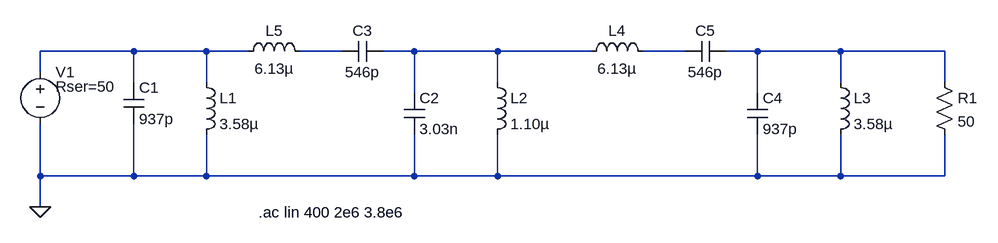
[diagram p0: schematic simple.asc]
simple.asc, the LTspice schematic file:
Version 4
SHEET 1 1604 692
WIRE 304 192 160 192
WIRE 416 192 304 192
WIRE 480 192 416 192
WIRE 624 192 560 192
WIRE 736 192 688 192
WIRE 864 192 736 192
WIRE 1008 192 864 192
WIRE 1152 192 1088 192
WIRE 1264 192 1216 192
WIRE 1392 192 1264 192
WIRE 1552 192 1392 192
WIRE 160 224 160 192
WIRE 304 240 304 192
WIRE 416 240 416 192
WIRE 864 240 864 192
WIRE 1392 240 1392 192
WIRE 1552 240 1552 192
WIRE 736 256 736 192
WIRE 1264 256 1264 192
WIRE 160 384 160 304
WIRE 304 384 304 304
WIRE 304 384 160 384
WIRE 416 384 416 320
WIRE 416 384 304 384
WIRE 736 384 736 320
WIRE 736 384 416 384
WIRE 864 384 864 320
WIRE 864 384 736 384
WIRE 1264 384 1264 320
WIRE 1264 384 864 384
WIRE 1392 384 1392 320
WIRE 1392 384 1264 384
WIRE 1552 384 1552 320
WIRE 1552 384 1392 384
WIRE 160 432 160 384
FLAG 160 432 0
SYMBOL voltage 160 208 R0
WINDOW 39 24 38 Left 2
SYMATTR SpiceLine Rser=50
SYMATTR InstName V1
SYMATTR Value ""
SYMATTR Value2 AC 1
SYMBOL cap 288 240 R0
SYMATTR InstName C1
SYMATTR Value 937p
SYMBOL cap 720 256 R0
SYMATTR InstName C2
SYMATTR Value 3.03n
SYMBOL cap 688 176 R90
WINDOW 0 0 32 VBottom 2
WINDOW 3 32 32 VTop 2
SYMATTR InstName C3
SYMATTR Value 546p
SYMBOL ind 400 224 R0
SYMATTR InstName L1
SYMATTR Value 3.58µ
SYMBOL ind 848 224 R0
SYMATTR InstName L2
SYMATTR Value 1.10µ
SYMBOL ind 464 208 R270
WINDOW 0 32 56 VTop 2
WINDOW 3 5 56 VBottom 2
SYMATTR InstName L5
SYMATTR Value 6.13µ
SYMBOL res 1536 224 R0
SYMATTR InstName R1
SYMATTR Value 50
SYMBOL cap 1248 256 R0
SYMATTR InstName C4
SYMATTR Value 937p
SYMBOL cap 1216 176 R90
WINDOW 0 0 32 VBottom 2
WINDOW 3 32 32 VTop 2
SYMATTR InstName C5
SYMATTR Value 546p
SYMBOL ind 1376 224 R0
SYMATTR InstName L3
SYMATTR Value 3.58µ
SYMBOL ind 992 208 R270
WINDOW 0 32 56 VTop 2
WINDOW 3 5 56 VBottom 2
SYMATTR InstName L4
SYMATTR Value 6.13µ
TEXT 496 440 Left 2 !.ac lin 400 2e6 3.8e6

The netlist it stands for:
* simple.asc
V1 N001 0 AC 1 Rser=50
C1 N001 0 937p
C2 N003 0 3.03n
C3 N003 N002 546p
L1 N001 0 3.58µ
L2 N003 0 1.10µ
L5 N001 N002 6.13µ
R1 N005 0 50
C4 N005 0 937p
C5 N005 N004 546p
L3 N005 0 3.58µ
L4 N003 N004 6.13µ
.ac lin 400 2e6 3.8e6
.backanno
.end